# EAGLE design eink_schematic (EAGLE 6.6.0)
AUTHOR: Cole Hudson; REV: A; TITLE: E-Ink
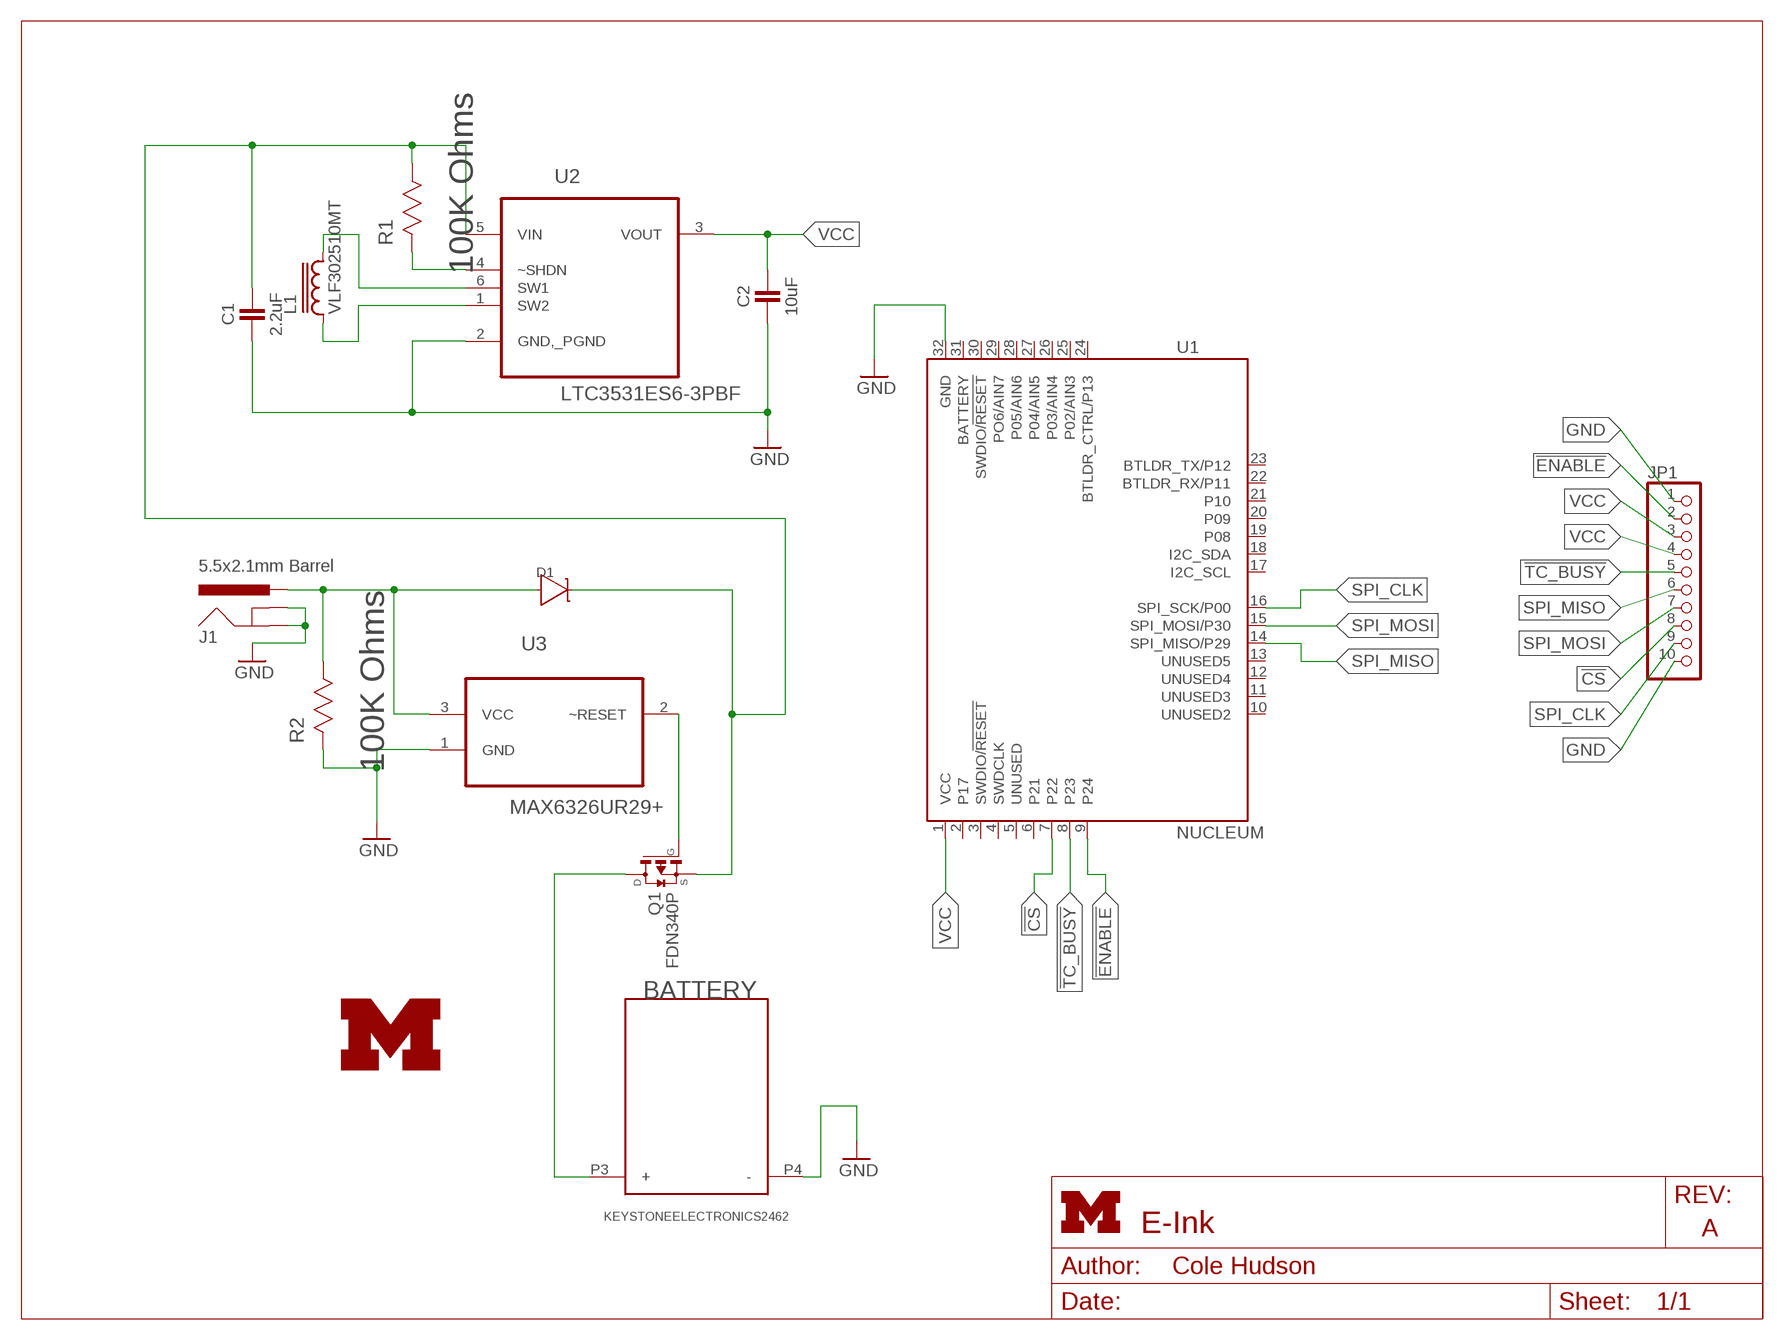
[diagram p0: schematic, sheet 1]
FRAME1 (LETTER_L): HEIGHT: 8.5in; WIDTH: 11in

## Parts
BATTERY  KEYSTONEELECTRONICS2462  [KEYSTONEELECTRONICS2462]
C1  2.2uF  CAPACITOR  [0402_CAP]
C2  10uF  CAPACITOR  [0402_CAP]
D1  DIODE[SCHOTKY]-SOD123W  [SOD123W]
J1  5.5x2.1mm Barrel  POWER_JACKSMD  [POWER_JACK_SMD]
JP1  PINHD-1X10/90  [1X10/90]
L1  VLF302510MT  [VLF302510MT]
LOGO1  UMICH_SOLID_LARGE  [UMICH_SOLID_350MIL]
Q1  FDN340P  [SSOT-3]
R1  100K Ohms  RC0603JR-07100KL  [RESC1608X60N]
R2  100K Ohms  RC0603JR-07100KL  [RESC1608X60N]
U1  NUCLEUM  [NUCLEUM]
U2  LTC3531ES6-3PBF  [SOT95P280X100-6N]
U3  MAX6326UR29+  [SOT95P228X119-3N]

## Nets
!CS: JP1.8 U1.7(P22)
!ENABLE: JP1.2 U1.9(P24)
!SHDN: R1.2(R2) U2.4(~SHDN)
!TC_BUSY: JP1.5 U1.8(P23)
GND: BATTERY.P4(-) C1.2 C2.2 J1.GND(GNDBREAK) J1.P$4(GND) JP1.1 JP1.10 R2.2(R2) U1.32(GND) U2.2(GND,_PGND) U3.1(GND)
N$1: Q1.1(G) U3.2(~RESET)
N$2: D1.P$1 J1.VIN0(PWR) R2.1(R1) U3.3(VCC)
N$3: C1.1 D1.P$2 Q1.2(S) R1.1(R1) U2.5(VIN)
N$4: BATTERY.P3(+) Q1.3(D)
SPI_CLK: JP1.9 U1.16(SPI_SCK/P00)
SPI_MISO: JP1.6 U1.14(SPI_MISO/P29)
SPI_MOSI: JP1.7 U1.15(SPI_MOSI/P30)
SW1: L1.2 U2.6(SW1)
SW2: L1.1 U2.1(SW2)
VCC: C2.1 JP1.3 JP1.4 U1.1(VCC) U2.3(VOUT)
Unconnected: U1.2(P17) U1.3(SWDIO/!RESET) U1.4(SWDCLK) U1.5(UNUSED) U1.6(P21) U1.10(UNUSED2) U1.11(UNUSED3) U1.12(UNUSED4) U1.13(UNUSED5) U1.17(I2C_SCL) U1.18(I2C_SDA) U1.19(P08) U1.20(P09) U1.21(P10) U1.22(BTLDR_RX/P11) U1.23(BTLDR_TX/P12) U1.24(BTLDR_CTRL/P13) U1.25(P02/AIN3) U1.26(P03/AIN4) U1.27(P04/AIN5) U1.28(P05/AIN6) U1.29(PO6/AIN7) U1.30(SWDIO/!RESET) U1.31(BATTERY)

## Library data of the parts
BATTERY = through_hole_battery_pack:KEYSTONEELECTRONICS2462; DIGIKEY: 36-2462-ND
C1 = passives:CAPACITOR: 0402 Capacitor; DIGIKEY: 490-3296-1-ND
C2 = passives:CAPACITOR: 0402 Capacitor; DIGIKEY: 490-10693-1-ND
D1 = nxp:DIODE[SCHOTKY]; DIGIKEY: SS15FACT-ND
J1 = SparkFun-Connectors:POWER_JACK: Power Jack This is the standard 5.5mm barrel jack for power. The PTH is the most common, proven, reliable, footprint. The Slot footprint only works if the mill layer is transmitted to the PCB fab house so be warned. Mating wall wart : TOL-00298 (and others); DIGIKEY: CP-002AHPJCT-ND; PROD_ID: CONN-08106; SF_ID: PRT-12748
JP1 = pinhead:PINHD-1X10: PIN HEADER; DIGIKEY: S5446-ND
L1 = inductor-tdk:VLF302510MT: POWER INDUCTOR; DIGIKEY: 445-6775-1-ND
LOGO1 = logos:UMICH_SOLID
Q1 = transistor-fet:FDN340P: P-Channel MOSFET Logic Level, PowerTrench MOSFET; DIGIKEY: FDN340PCT-ND
R1 = Yageo_By_element14_Batch_1:RC0603JR-07100KL: RESISTOR, 0603; DIGIKEY: 311-100KGRCT-ND; MPN: RC0603JR-07100KL; OC_FARNELL: 9233628; OC_NEWARK: 98K7287; SUPPLIER: Yageo; TOLERANCE: ±5%; WATTAGE: 1/10 W
R2 = Yageo_By_element14_Batch_1:RC0603JR-07100KL: RESISTOR, 0603; MPN: RC0603JR-07100KL; OC_FARNELL: 9233628; OC_NEWARK: 98K7287; SUPPLIER: Yageo; TOLERANCE: ±5%; WATTAGE: 1/10 W
U1 = nucleum:NUCLEUM: Nucleum sensorboard prototyping module.
U2 = LTC_By_element14_Batch_1:LTC3531ES6-3PBF: DC/DC Converters; DIGIKEY: LTC3531ES6-3.3#TRMPBFCT-ND; MPN: LTC3531ES6-3#PBF; OC_FARNELL: -; OC_NEWARK: 46P4583; PACKAGE: TSOT-23-6; SUPPLIER: Linear Technology
U3 = Maxim_By_element14_Batch_1:MAX6326UR29+: 3-Pin, Ultra-Low-Power SC70/SOT ìP Reset Circuits; DIGIKEY: MAX6326UR29+TCT-ND; MPN: MAX6326UR29+; OC_FARNELL: 9723951; OC_NEWARK: -; PACKAGE: SOT-23-3; SUPPLIER: Maxim

## Board
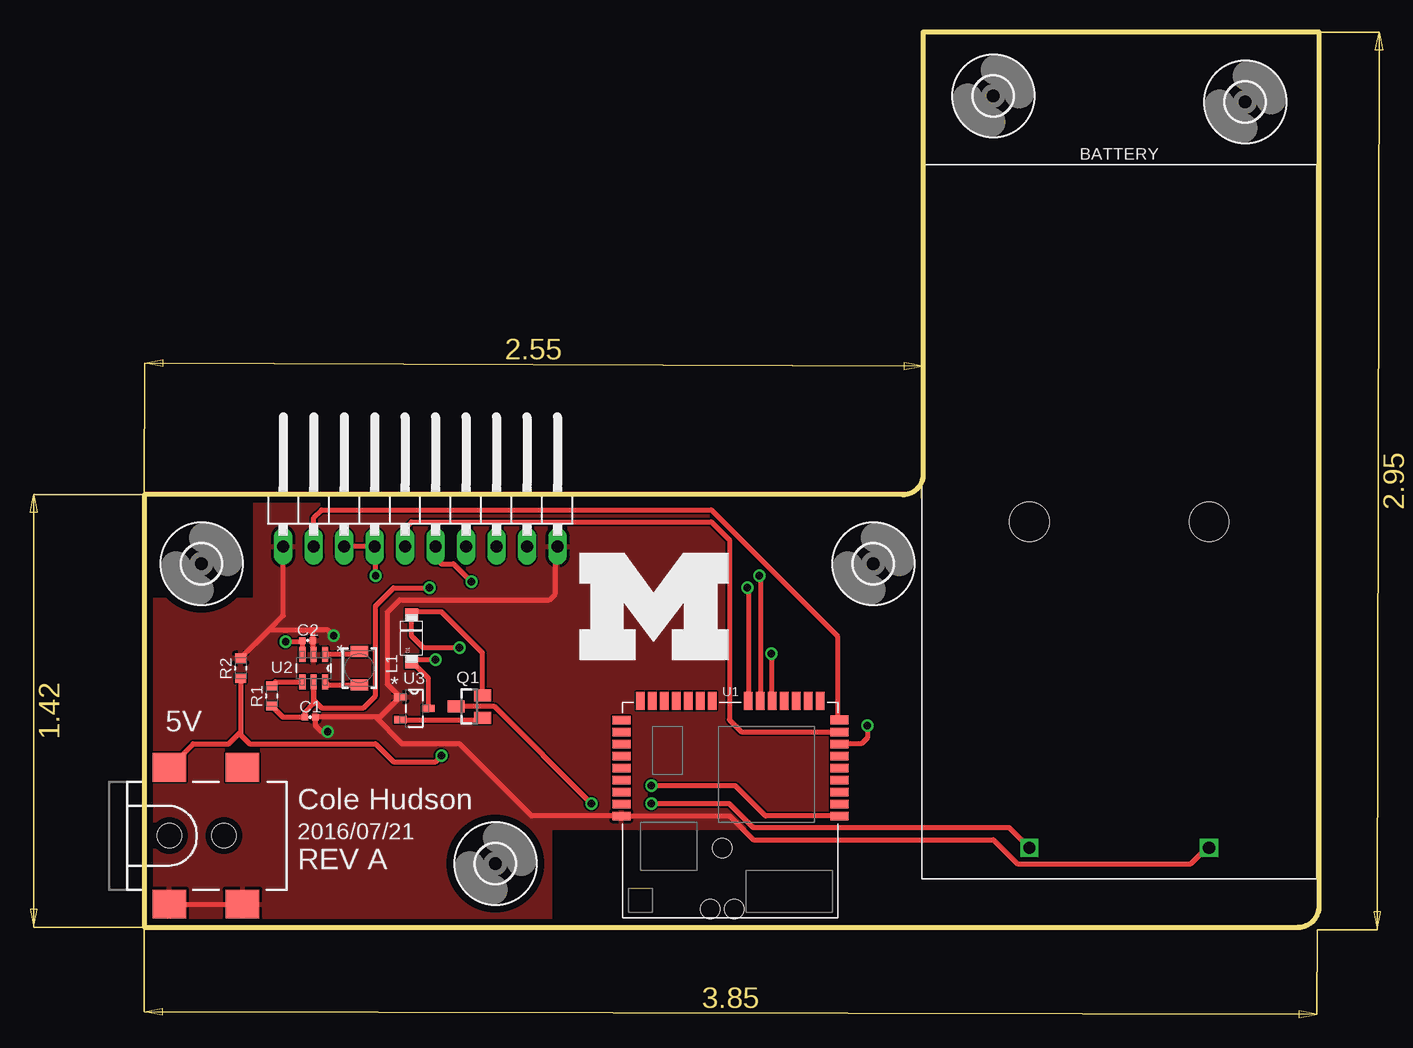
[diagram p1: board, top side]
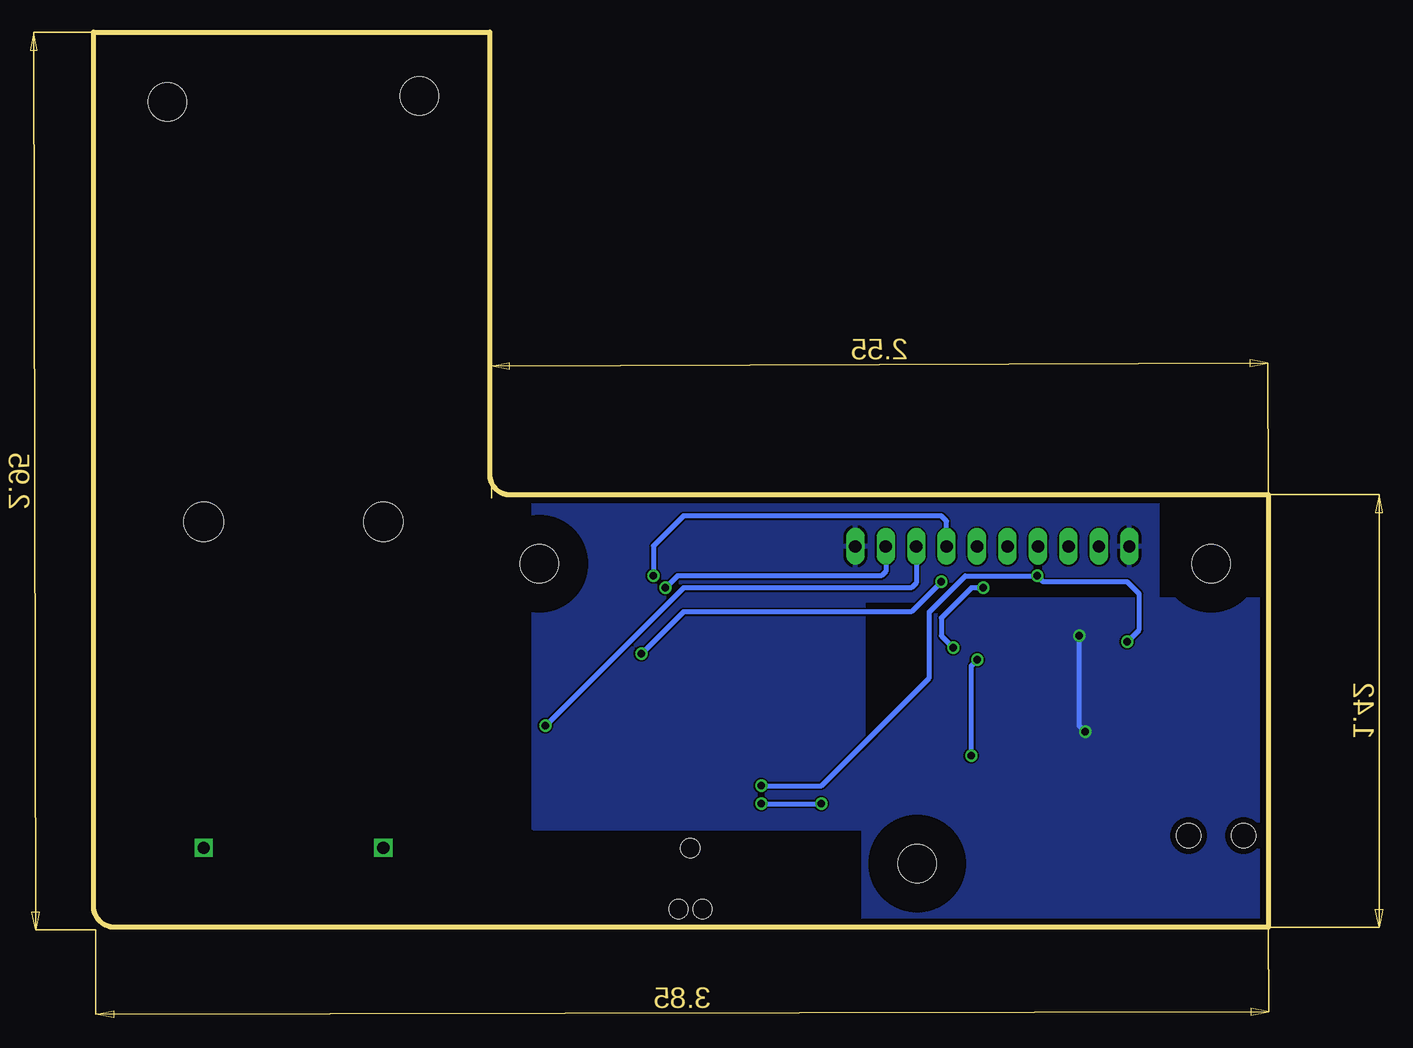
[diagram p2: board, bottom side, seen from below]

Size 97.94 x 74.62 mm. Coordinates in mm from the lower left corner, seen from the top.
Outline: 0,0 96.19,0 arc90 97.94,1.75 97.94,74.62 64.92,74.62 64.92,37.75 arc-90 63.23,36.06 0,36.06 0,0
Copper layers (1*16): Top 0.0178mm / dielectric 59mil / Bottom 0.0178mm
Design rules "sunstone-2lyr_v1.0.0.3": minimum track width 6mil, minimum drill 14mil, track to track 6mil, track to pad 6mil, pad to pad 6mil, via to via 6mil, smd to smd 6mil, copper to edge 20mil, drill to drill 16mil, minimum pad ring 8mil, minimum via ring 8mil, stop-mask expansion 3mil, vias tented up to drill 50mil, thermal gap 10mil

### Footprints (pad centres in the part's own frame; a part is rotated, then mirrored left to right if it is on the bottom)
KEYSTONEELECTRONICS2462 = drill 1.016 square: P3 -7.493,-27.178; P4 7.493,-27.178 | hole 3.302: -7.493,0; 7.493,0
0402_CAP = smd 0.536 x 0.546: 1 -0.433,0; 2 0.433,0
SOD123W = smd 1.1 x 1.1: P$1 -1.95,0; P$2 1.95,0
POWER_JACK_SMD = smd 2.8 x 2.4: GND 0,-5.7; P$4 6.1,-5.7; VIN0 0,5.7; VIN1 6.1,5.7 | hole 2.032: 0,0; 4.572,0
1X10/90 = drill 1.016 long: 1 -11.43,-3.81; 2 -8.89,-3.81; 3 -6.35,-3.81; 4 -3.81,-3.81; 5 -1.27,-3.81; 6 1.27,-3.81; 7 3.81,-3.81; 8 6.35,-3.81; 9 8.89,-3.81; 10 11.43,-3.81
VLF302510MT = smd 0.9 x 1.45: 1 -1.4,0; 2 1.4,0
SSOT-3 = smd 1 x 1.4: 1 -0.95,-1.1; 2 0.95,-1.1; 3 0,1.1
RESC1608X60N = smd 0.762 x 0.94: 1 -0.838,0; 2 0.838,0
NUCLEUM = smd 0.7 x 1.5: 1 8.481,-0.109; 2 9.481,-0.109; 3 10.481,-0.109; 4 11.481,-0.109; 5 12.481,-0.109; 6 13.481,-0.109; 7 14.481,-0.109; 8 15.481,-0.109; 24 16.481,18.049; 25 15.481,18.049; 26 14.481,18.049; 27 13.481,18.049; 28 12.481,18.049; 29 11.481,18.049; 30 10.481,18.049; 31 9.481,18.049; 32 8.481,18.049 | smd 0.754 x 1.5: 9 16.481,-0.109 | smd 1.5 x 0.7: 10 18.06,1.47; 11 18.06,2.47; 12 18.06,3.47; 13 18.06,4.47; 14 18.06,5.47; 15 18.06,6.47; 16 18.06,7.47; 17 18.06,10.47; 18 18.06,11.47; 19 18.06,12.47; 20 18.06,13.47; 21 18.06,14.47; 22 18.06,15.47; 23 18.06,16.47 | hole 1.6: 0.72,8.66; 0.72,10.66; 5.8,9.64
SOT95P280X100-6N = smd 1.219 x 0.508: 1 -1.143,0.94; 2 -1.143,0; 3 -1.143,-0.94; 4 1.143,-0.94; 5 1.143,0; 6 1.143,0.94
SOT95P228X119-3N = smd 1.016 x 0.61: 1 -1.168,0.94; 2 -1.168,-0.94; 3 1.168,0
3,2 = hole 3.2: 0,0

### Placement (x,y rotation side)
BATTERY  81.27,33.8 0 top
C1  13.82,17.51 0 top
C2  13.62,23.9 0 top
D1  22.28,24.09 90 top
J1  2.08,7.62 0 top
JP1  23.01,35.56 0 top
L1  17.93,21.59 270 top
LOGO1  36.27,22.3 0 top
Q1  27.09,18.39 90 top
R1  10.62,19.28 90 top
R2  8.04,21.59 90 top
U1  57.83,0.79 90 top
U2  14.12,21.59 270 top
U3  22.51,18.24 0 top
U$1  [3,2]  4.77,30.3 0 top
U$2  [3,2]  29.27,5.3 0 top
U$3  [3,2]  60.77,30.3 0 top
U$4  [3,2]  91.77,68.8 0 top
U$5  [3,2]  70.77,69.3 0 top

### Tracks (layer width: path | path; a pad name or v marks a point on that pad's centre or on a via)
!CS  (via drill 0.6)
  Top 0.406: v60.27,16.8 60.27,15.8 59.77,15.3 57.97,15.3 U1.7
  Bottom 0.406: JP1.8 29.36,28.71 29.77,28.3 48.77,28.3 v60.27,16.8
!ENABLE
  Top 0.406: JP1.2 14.12,34.15 14.77,34.8 47.27,34.8 57.77,24.3 57.77,17.44 U1.9
!SHDN
  Top 0.406: R1.2 10.95,20.45 U2.4
!TC_BUSY
  Top 0.406: JP1.5 21.74,33.27 22.27,33.8 47.27,33.8 48.77,32.3 48.77,17.3 49.77,16.3 57.91,16.3 U1.8
GND  (via drill 0.6)
  Top 0.406: 19.27,17.51 19.67,17.51 U3.1 20.27,20.25 20.27,26.3 21.27,27.3 33.77,27.3 34.27,27.8 34.27,31.58 JP1.10 | 19.27,17.51 C1.2 14.25,16.82 14.77,16.3 v15.27,16.3 | R2.2 10.41,24.8 | 10.41,24.8 13.77,24.8 | 13.77,24.8 14.05,24.52 C2.2 14.05,22.8 U2.2 | 10.41,24.8 11.58,25.97 JP1.1 | 19.27,17.51 21.48,15.3 26.27,15.3 32.3,9.27 U1.32 48.8,9.27 50.77,7.3 70.77,7.3 72.77,5.3 87.26,5.3 88.58,6.62 BATTERY.P4 | v15.77,24.3 15.27,24.8 13.77,24.8 | J1.GND J1.P$4
  Bottom 0.406: v15.27,16.3 15.77,16.8 v15.77,24.3
  pour Top: 0.27,27.3 33.77,27.3 33.77,0.3 0.27,0.3
  pour Bottom: 0.27,27.3 33.77,27.3 33.77,0.3 0.27,0.3
  pour Bottom: 9.27,35.8 61.27,35.8 61.27,8.3 33.77,8.3 33.77,27.3 9.27,27.3
  pour Top: 9.27,35.8 61.27,35.8 61.27,8.3 33.77,8.3 33.77,27.3 9.27,27.3
N$1
  Top 0.406: U3.2 28.05,17.3 Q1.1
N$2  (via drill 0.6)
  Top 0.406: U3.3 23.68,20.74 D1.P$1 22.44,22.3 v24.27,22.3 | 8.04,16.3 8.04,16.28 8.04,16.03 8.77,15.3 19.27,15.3 20.77,13.8 24.27,13.8 v24.77,14.3 | R2.1 8.04,16.3 | J1.VIN0 4.06,15.3 7.04,15.3 8.04,16.3
  Bottom 0.406: v24.77,14.3 24.77,21.8 v24.27,22.3
N$3  (via drill 0.6)
  Top 0.406: Q1.2 28.19,22.88 24.77,26.3 22.54,26.3 D1.P$2 22.27,24.3 23.27,23.3 v26.27,23.3 | R1.1 11.55,17.51 C1.1 13.39,17.92 14.12,18.65 U2.5 14.12,18.95 14.77,18.3 18.27,18.3 19.27,19.3 19.27,26.8 20.77,28.3 v23.77,28.3
  Bottom 0.406: v23.77,28.3 24.77,28.3 27.27,25.8 27.27,24.3 v26.27,23.3
N$4  (via drill 0.6)
  Top 0.406: v42.27,10.3 48.77,10.3 50.77,8.3 70.27,8.3 70.77,8.3 72.1,8.3 BATTERY.P3 | v37.27,10.3 29.18,18.39 Q1.3
  Bottom 0.406: v42.27,10.3 v37.27,10.3
SPI_CLK  (via drill 0.6)
  Top 0.406: v50.27,28.3 50.36,28.21 U1.16
  Bottom 0.406: JP1.9 31.9,29.67 32.27,29.3 49.27,29.3 v50.27,28.3
SPI_MISO  (via drill 0.6)
  Top 0.406: JP1.6 24.28,30.79 24.77,30.3 25.77,30.3 v27.27,28.8 | v52.27,22.8 52.27,18.94 U1.14
  Bottom 0.406: v27.27,28.8 29.77,26.3 48.77,26.3 v52.27,22.8
SPI_MOSI  (via drill 0.6)
  Top 0.406: v51.27,29.3 51.36,29.21 U1.15
  Bottom 0.406: JP1.7 26.82,33.85 27.27,34.3 48.77,34.3 51.27,31.8 v51.27,29.3
SW1
  Top 0.406: U2.6 15.32,20.19 L1.2
SW2
  Top 0.406: L1.1 17.67,22.73 U2.1
VCC  (via drill 0.6)
  Top 0.406: U2.3 C2.1 13.09,23.8 v11.77,23.8 | v19.27,29.3 19.27,31.68 JP1.4 JP1.3 | U1.1 51.8,9.27 49.27,11.8 v42.27,11.8
  Bottom 0.406: v11.77,23.8 10.77,24.8 10.77,27.8 11.77,28.8 18.77,28.8 v19.27,29.3 25.27,29.3 28.27,26.3 28.27,20.8 37.27,11.8 v42.27,11.8

### Text on the board
tPlace: 5V | Cole Hudson | 2016/07/21
tNames: REV A